# EAGLE design LurkerNanov12 (EAGLE 6.6.0)
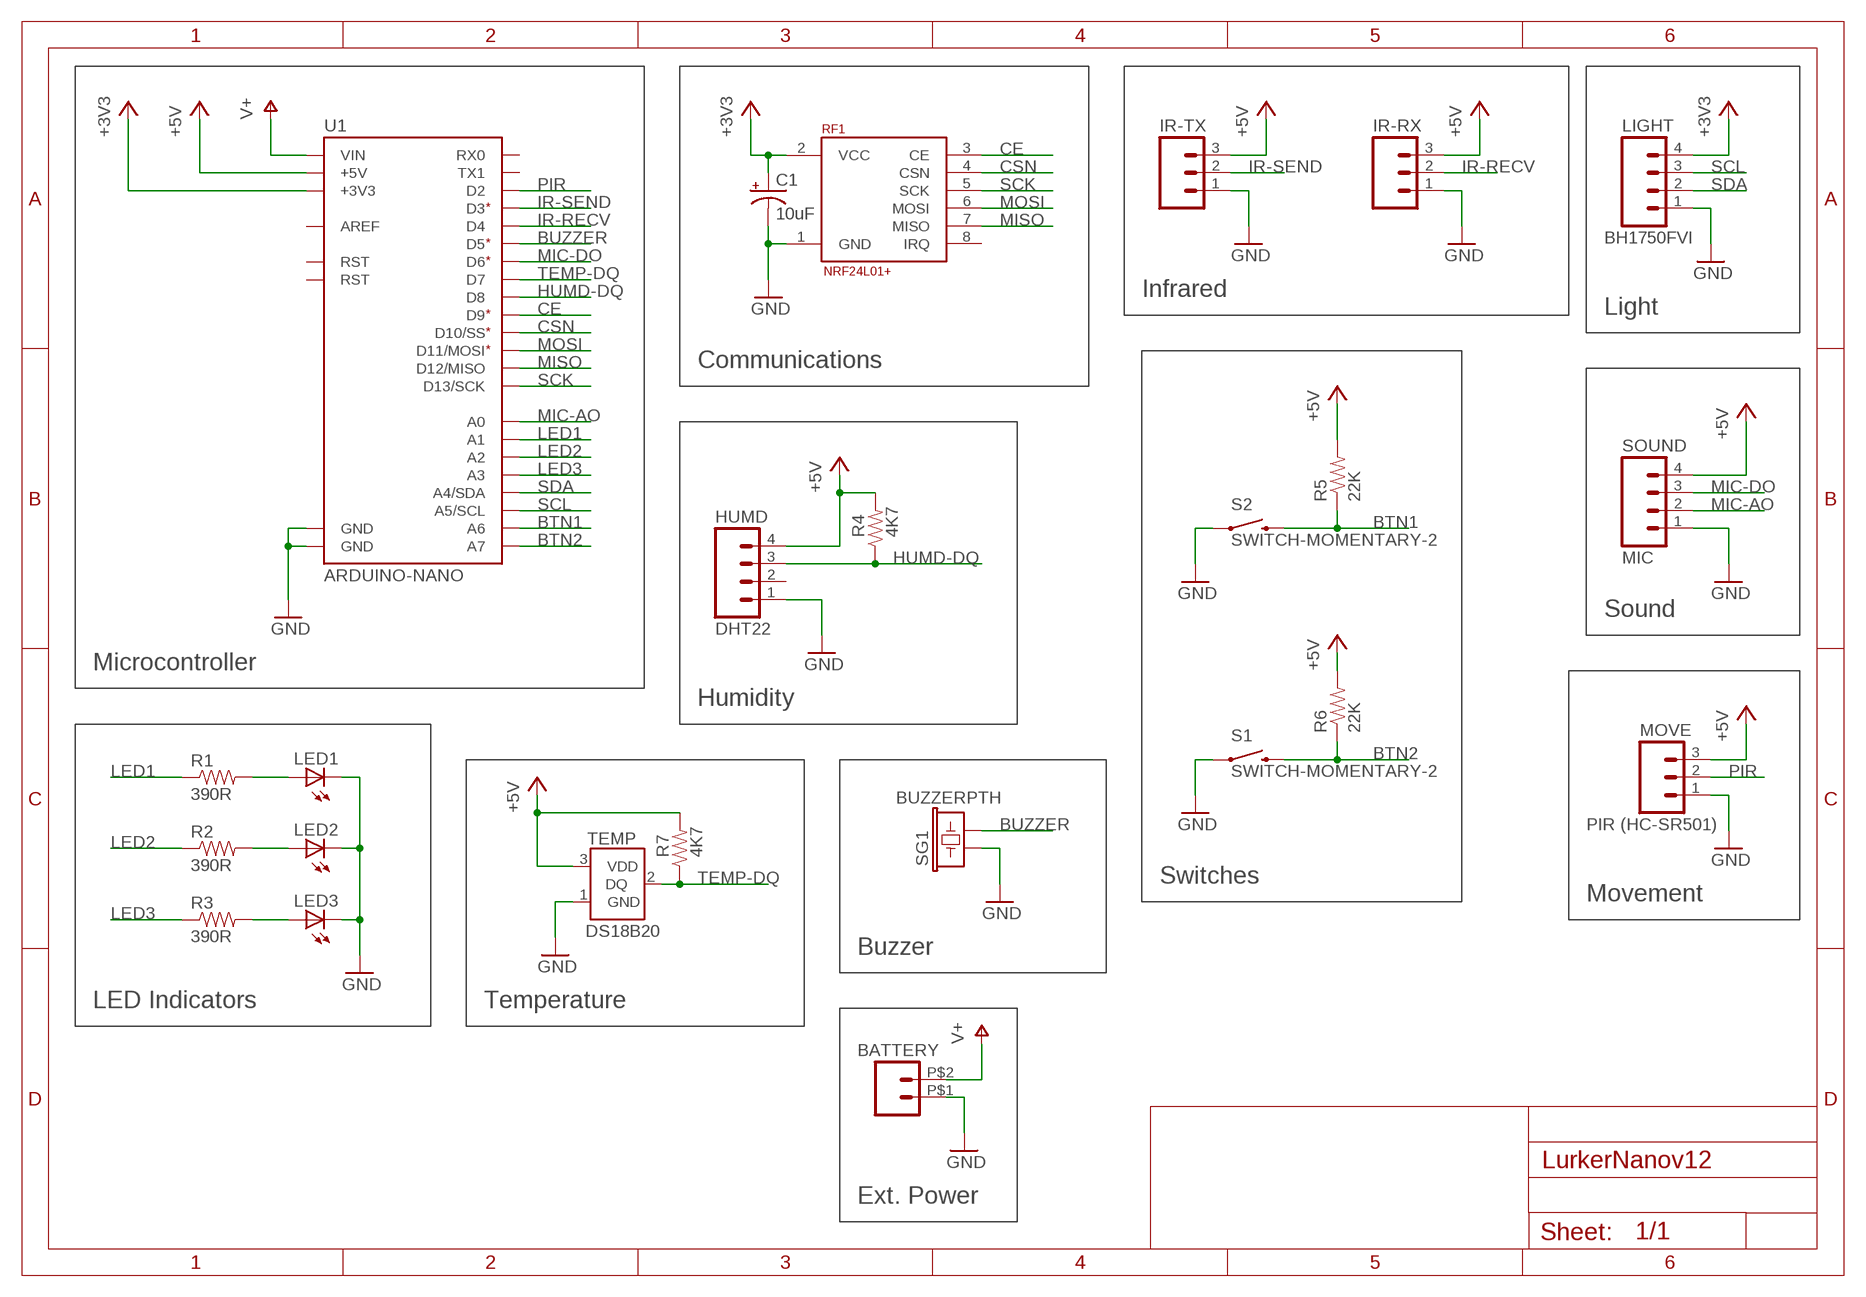
[diagram p0: schematic, sheet 1, part 1 of 2]
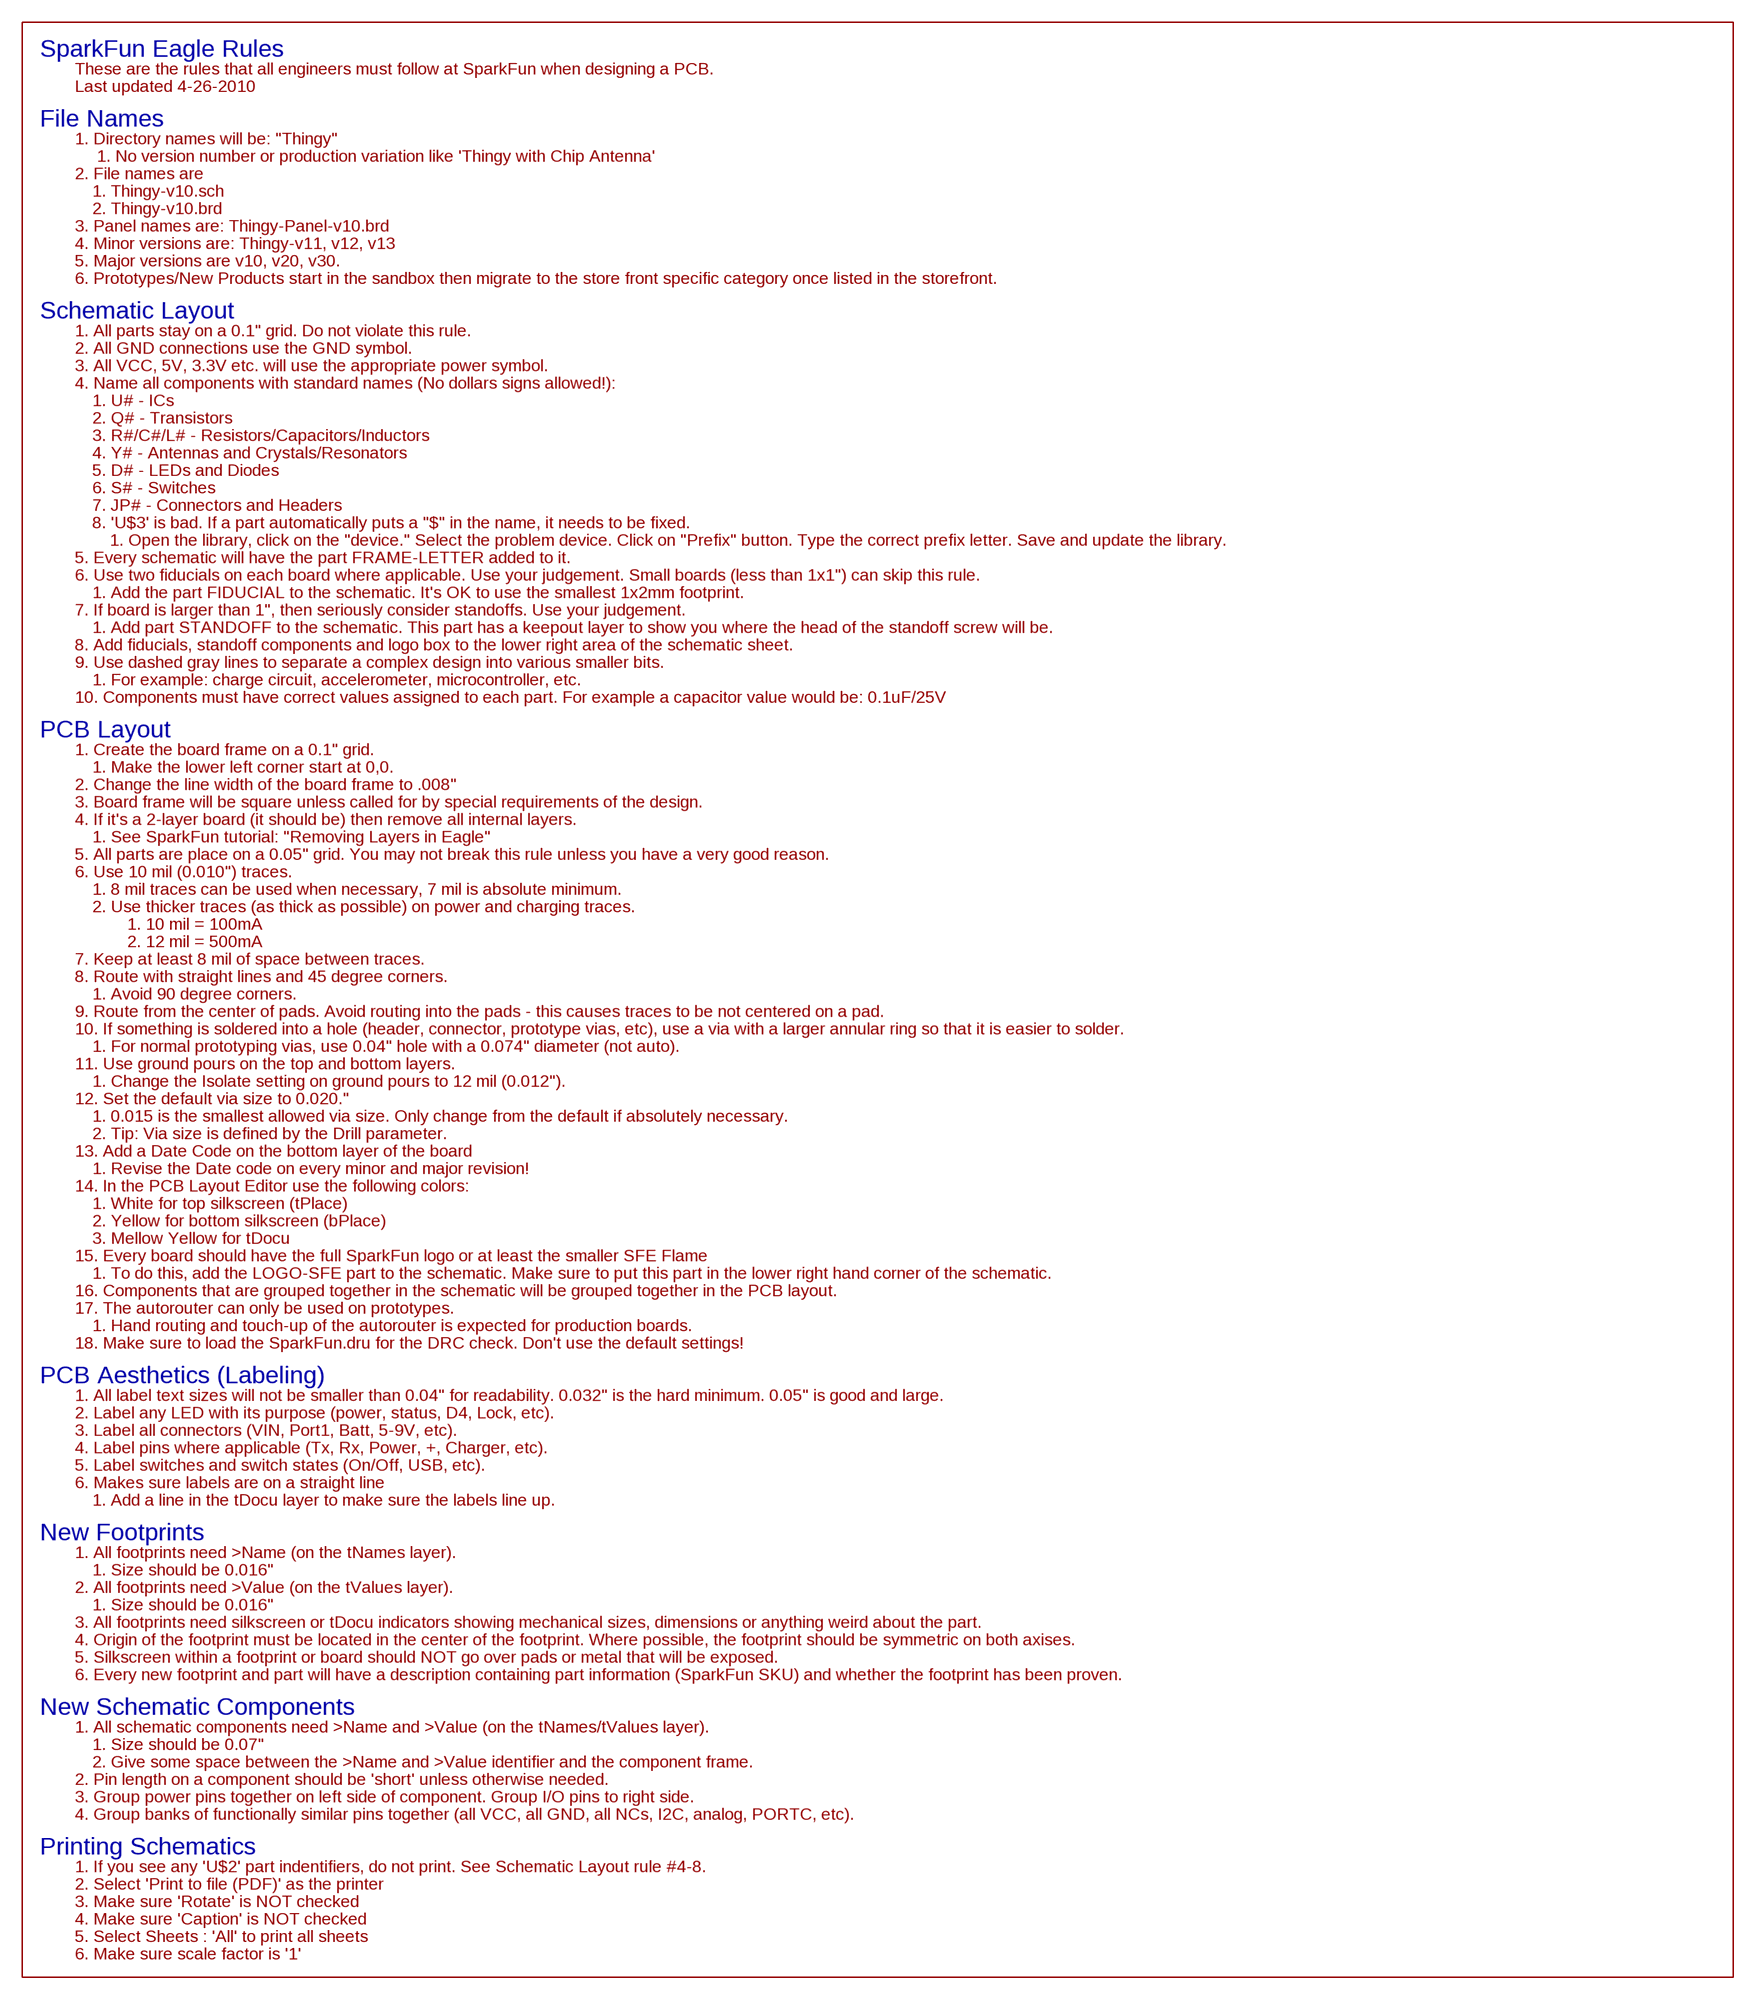
[diagram p1: schematic, sheet 1, part 2 of 2]

## Parts
BATTERY  M02PTH2  [1X02_BIG]
C1  10uF  CAP_POL1206  [EIA3216]
HUMD  DHT22  M04PTH  [1X04]
IR-RX  M03PTH  [1X03]
IR-TX  M03PTH  [1X03]
LED1  LED1206  [LED-1206]
LED2  LED1206  [LED-1206]
LED3  LED1206  [LED-1206]
LIGHT  BH1750FVI  M04PTH  [1X04]
MOVE  PIR (HC-SR501)  M03PTH  [1X03]
R1  390R  RESISTOR1206  [1206]
R2  390R  RESISTOR1206  [1206]
R3  390R  RESISTOR1206  [1206]
R4  4K7  RESISTOR1206  [1206]
R5  22K  RESISTOR1206  [1206]
R6  22K  RESISTOR1206  [1206]
R7  4K7  RESISTOR1206  [1206]
RF1  NRF24L01+  [NRF24L01+-HEADER]
S1  SWITCH-MOMENTARY-2  [TACTILE_SWITCH_TALL]
S2  SWITCH-MOMENTARY-2  [TACTILE_SWITCH_TALL]
SG1  BUZZERPTH  [BUZZER-12MM]
SOUND  MIC  M04PTH  [1X04]
TEMP  DS18B20  [TO-92-AMMO]
U1  ARDUINO-NANO  [NANO-SHIELD]

## Nets
+3V3: C1.A(+) LIGHT.4 RF1.2(VCC) U1.3V3(+3V3)
+5V: HUMD.4 IR-RX.3 IR-TX.3 MOVE.3 R4.2 R5.2 R6.2 R7.2 SOUND.4 TEMP.3(VDD) U1.5V(+5V)
BTN1: R5.1 S2.B2 U1.A6
BTN2: R6.1 S1.B2 U1.A7
BUZZER: SG1.- U1.D5
CE: RF1.3(CE) U1.D9
CSN: RF1.4(CSN) U1.D10(D10/SS)
GND: BATTERY.P$1 C1.C(-) HUMD.1 IR-RX.1 IR-TX.1 LED1.C LED2.C LED3.C LIGHT.1 MOVE.1 RF1.1(GND) S1.A2 S2.A2 SG1.+ SOUND.1 TEMP.1(GND) U1.GND@0(GND) U1.GND@1(GND)
HUMD-DQ: HUMD.3 R4.1 U1.D8
IR-RECV: IR-RX.2 U1.D4
IR-SEND: IR-TX.2 U1.D3
LED1: R1.1 U1.A1
LED2: R2.1 U1.A2
LED3: R3.1 U1.A3
MIC-AO: SOUND.2 U1.A0
MIC-DO: SOUND.3 U1.D6
MISO: RF1.7(MISO) U1.D12(D12/MISO)
MOSI: RF1.6(MOSI) U1.D11(D11/MOSI)
N$1: LED1.A R1.2
N$2: LED2.A R2.2
N$3: LED3.A R3.2
PIR: MOVE.2 U1.D2
SCK: RF1.5(SCK) U1.D13(D13/SCK)
SCL: LIGHT.3 U1.A5(A5/SCL)
SDA: LIGHT.2 U1.A4(A4/SDA)
TEMP-DQ: R7.1 TEMP.2(DQ) U1.D7
V+: BATTERY.P$2 U1.VIN
Unconnected: HUMD.2 RF1.8(IRQ) U1.REF(AREF) U1.RST U1.RST@0(RST) U1.RX(RX0) U1.TX(TX1)

## Notes on the sheet
- Infrared
- Light
- Communications
- Sound
- Microcontroller
- Humidity
- Switches
- Movement
- Buzzer
- LED Indicators | Temperature
- Ext. Power

## Library data of the parts
BATTERY = SparkFun-Connectors:M02: Header 2 Standard 2-pin 0.1" header. Use with straight break away headers (SKU : PRT-00116), right angle break away headers (PRT-00553), swiss pins (PRT-00743), machine pins (PRT-00117), and female headers (PRT-00115). Molex polarized connector foot print use with SKU : PRT-08233 with associated crimp pins and housings.
C1 = SparkFun-Capacitors:CAP_POL: Capacitor Polarized These are standard SMD and PTH capacitors. Normally 10uF, 47uF, and 100uF in electrolytic and tantalum varieties. Always verify the external diameter of the through hole cap, it varies with capacity, voltage, and manufacturer. The EIA devices should be standard.
HUMD LIGHT SOUND = SparkFun-Connectors:M04: Header 4 Standard 4-pin 0.1" header. Use with straight break away headers (SKU : PRT-00116), right angle break away headers (PRT-00553), swiss pins (PRT-00743), machine pins (PRT-00117), and female headers (PRT-00115). Molex polarized connector foot print use with SKU : PRT-08231 with associated crimp pins and housings. 1MM SMD Version SKU: PRT-10208
IR-RX IR-TX MOVE = SparkFun-Connectors:M03: Header 3 Standard 3-pin 0.1" header. Use with straight break away headers (SKU : PRT-00116), right angle break away headers (PRT-00553), swiss pins (PRT-00743), machine pins (PRT-00117), and female headers (PRT-00115). Molex polarized connector foot print use with SKU : PRT-08232 with associated crimp pins and housings.
LED1-LED3 = SparkFun-LED:LED: LEDs Standard schematic elements and footprints for 5mm, 3mm, 1206, and 0603 sized LEDs. 5mm - Spark Fun Electronics SKU : COM-00529 (and others)
R1-R7 = SparkFun-Resistors:RESISTOR: Resistor Basic schematic elements and footprints for 0603, 1206, and PTH resistors.
RF1 = Leenix:NRF24L01+
S1 S2 = SparkFun-Electromechanical:SWITCH-MOMENTARY-2: Various NO switches- pushbuttons, reed, etc
SG1 = SparkFun-Electromechanical:BUZZER: Buzzer 12mm Spark Fun Electronics SKU : Comp-Buzzer
TEMP = Leenix:DS18B20
U1 = Leenix:ARDUINO-NANO

## Board
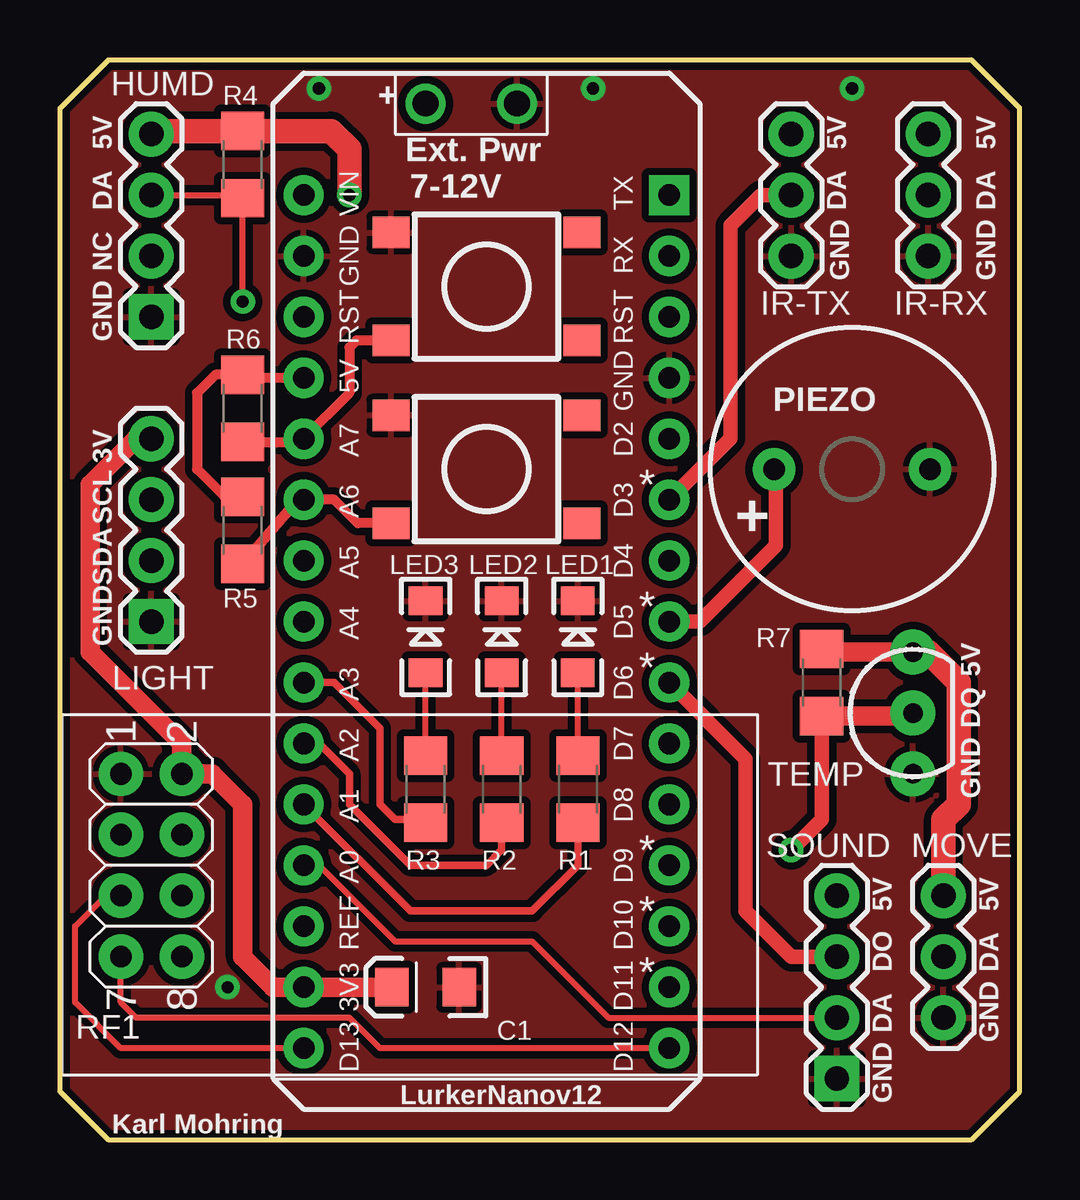
[diagram p2: board, top side]
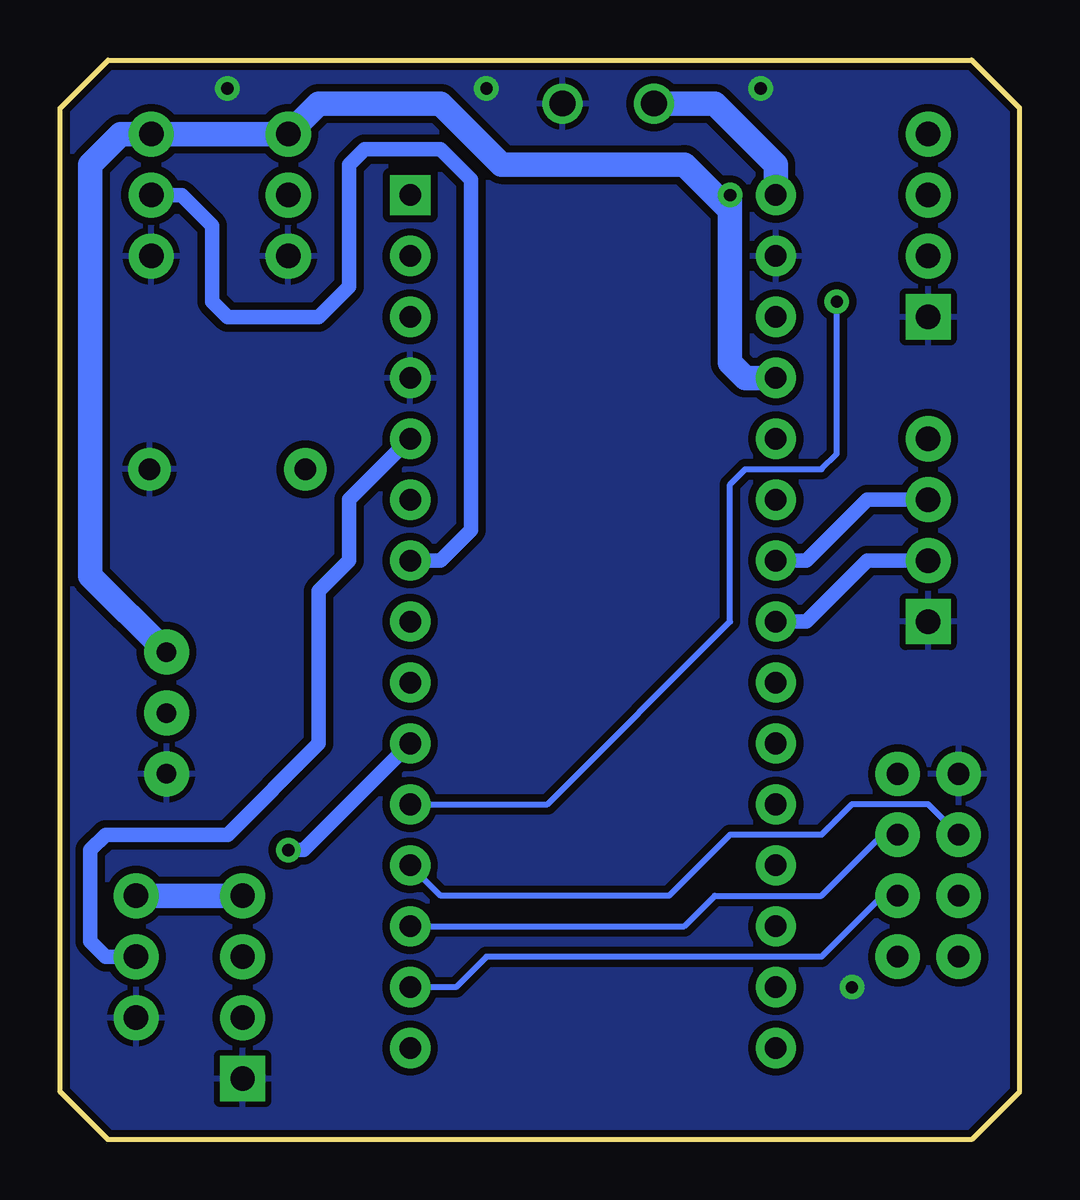
[diagram p3: board, bottom side, seen from below]

Size 40 x 45 mm. Coordinates in mm from the lower left corner, seen from the top.
Outline: 2,0 38,0 40,2 40,43 38,45 2,45 0,43 0,2 2,0
Copper layers (1*16): Top 0.035mm / dielectric 1.5mm / Bottom 0.035mm
Design rules "SparkFun": minimum track width 8mil, minimum drill 20mil, track to track 8mil, track to pad 8mil, pad to pad 8mil, via to via 8mil, smd to smd 8mil, copper to edge 10mil, drill to drill 8mil, minimum pad ring 12mil, minimum via ring 10mil, stop-mask expansion 4mil, vias tented up to drill 25mil, thermal gap 10mil

### Footprints (pad centres in the part's own frame; a part is rotated, then mirrored left to right if it is on the bottom)
1X02_BIG = drill 1.067: P$1 0,0; P$2 3.81,0
EIA3216 = smd 1.4 x 1.6: A 1.4,0; C -1.4,0
1X04 = drill 1.016 pad 1.88 square: 1 0,0 | drill 1.016 pad 1.88: 2 2.54,0; 3 5.08,0; 4 7.62,0
1X03 = drill 1.016 pad 1.88: 1 0,0; 2 2.54,0; 3 5.08,0
LED-1206 = smd 1.2 x 1.4: A -1.5,0; C 1.5,0
1206 = smd 1.6 x 1.8: 1 -1.4,0; 2 1.4,0
NRF24L01+-HEADER = drill 0.9 pad 1.85: 1 -2.54,-2.54; 2 -2.54,0; 3 0,-2.54; 4 0,0; 5 2.54,-2.54; 6 2.54,0; 7 5.08,-2.54; 8 5.08,0
TACTILE_SWITCH_TALL = smd 1.55 x 1.3: A1 -3.975,-2.25; A2 3.975,-2.25; B1 -3.975,2.25; B2 3.975,2.25
BUZZER-12MM = drill 0.9 pad 1.778: + 3.25,0; - -3.25,0
TO-92-AMMO = drill 0.813 pad 1.88: 1 -2.54,0; 2 0,0; 3 2.54,0
NANO-SHIELD = drill 0.9 pad 1.676: 3V3 0,2.54; 5V 0,27.94; A0 0,7.62; A1 0,10.16; A2 0,12.7; A3 0,15.24; A4 0,17.78; A5 0,20.32; A6 0,22.86; A7 0,25.4; D2 15.24,25.4; D3 15.24,22.86; D4 15.24,20.32; D5 15.24,17.78; D6 15.24,15.24; D7 15.24,12.7; D8 15.24,10.16; D9 15.24,7.62; D10 15.24,5.08; D11 15.24,2.54; D12 15.24,0; D13 0,0; GND@0 15.24,27.94; GND@1 0,33.02; REF 0,5.08; RST 0,30.48; RST@0 15.24,30.48; RX 15.24,33.02; VIN 0,35.56 | drill 0.9 pad 1.676 square: TX 15.24,35.56

### Placement (x,y rotation side)
BATTERY  19.05,43.18 180 top
C1  15.24,6.35 180 top
HUMD  3.81,34.29 90 top
IR-RX  36.2,36.83 90 top
IR-TX  30.48,36.83 90 top
LED1  21.59,20.95 90 top
LED2  18.41,20.95 90 top
LED3  15.24,20.95 90 top
LIGHT  3.81,21.59 90 top
MOVE  36.83,5.08 90 top
R1  21.59,14.61 90 top
R2  18.41,14.61 90 top
R3  15.24,14.61 90 top
R4  7.62,40.64 90 top
R5  7.62,25.4 90 top
R6  7.62,30.48 90 top
R7  31.75,19.05 90 top
RF1  5.08,12.7 270 top
S1  17.78,35.56 180 top
S2  17.78,27.94 180 top
SG1  33.02,27.94 0 top
SOUND  32.38,2.54 90 top
TEMP  35.56,17.78 90 top
U1  10.16,3.81 0 top

### Tracks (layer width: path | path; a pad name or v marks a point on that pad's centre or on a via)
+3V3
  Top 0.813: LIGHT.4 3.17,29.21 1.27,27.3 1.27,20.32 5.08,16.51 RF1.2 6.35,15.24 7.62,13.97 7.62,7.62 8.89,6.35 U1.3V3 C1.A
+5V  (via drill 0.51)
  Top 0.406: U1.5V 7.75,31.75 R6.2 6.48,31.88 5.71,31.11 5.71,27.94 6.86,26.8 R5.2
  Top 0.813: TEMP.3 31.88,20.32 R7.2
  Top 1.016: MOVE.3 36.83,13.34 37.47,13.97 37.47,19.05 36.2,20.32 TEMP.3 | HUMD.4 3.94,42.04 R4.2 11.3,42.04 12.06,41.27 v12.06,39.37
  Bottom 1.016: TEMP.3 38.73,23.5 38.73,40.64 37.47,41.91 IR-RX.3 IR-TX.3 29.21,43.18 24.13,43.18 21.59,40.64 13.97,40.64 12.06,38.73 | MOVE.3 SOUND.4 | U1.5V 11.43,31.75 12.06,32.38 12.06,38.73 | v12.06,39.37 12.06,38.73
BTN1
  Top 0.406: S2.B2 12.41,25.69 11.43,26.67 U1.A6 10.03,26.8 R5.1
BTN2
  Top 0.406: R6.1 10.03,29.08 U1.A7 12.06,31.11 12.06,33.02 12.36,33.31 S1.B2
BUZZER
  Top 0.61: U1.D5 26.67,21.59 29.84,24.77 29.84,27.86 SG1.-
CE
  Bottom 0.254: RF1.3 3.81,13.97 6.99,13.97 8.26,12.7 12.06,12.7 14.61,10.16 24.13,10.16 U1.D9
CSN
  Bottom 0.254: U1.D10 13.97,8.89 12.7,10.16 8.26,10.16 5.71,12.7 RF1.4
GND  (via drill 0.51)
  other vias: 33.02,43.81 10.79,43.81 22.23,43.81 6.99,6.35
  pour Top (isolate 0.305): 0,0 0,43.18 1.91,45.09 40.64,45.09 40.64,2.54 38.1,0
  pour Bottom (isolate 0.305): 40.64,0 40.64,42.55 38.1,45.09 -0.64,45.09 -0.64,2.54 1.91,0
HUMD-DQ  (via drill 0.51)
  Top 0.254: 6.99,38.6 R4.1 | HUMD.3 7.49,39.37 R4.1 | v7.62,34.92 R4.1
  Bottom 0.254: U1.D8 19.68,13.97 12.06,21.59 12.06,27.3 11.43,27.94 8.26,27.94 7.62,28.57 v7.62,34.92
IR-RECV
  Bottom 0.61: U1.D4 24.13,24.13 22.86,25.4 22.86,40.01 24.13,41.27 27.3,41.27 27.94,40.64 27.94,35.56 29.21,34.29 33.02,34.29 33.66,34.92 33.66,38.1 34.92,39.37 IR-RX.2
IR-SEND
  Top 0.61: IR-TX.2 29.21,39.37 27.94,38.1 27.94,29.21 U1.D3
LED1
  Top 0.305: U1.A1 14.61,9.53 19.68,9.53 21.59,11.43 R1.1
LED2
  Top 0.305: U1.A2 10.79,16.51 12.06,15.24 12.06,13.97 14.61,11.43 17.78,11.43 18.41,12.06 R2.1
LED3
  Top 0.305: U1.A3 11.43,19.05 13.34,17.14 13.34,13.97 13.97,13.34 15.11,13.34 R3.1
MIC-AO
  Top 0.254: U1.A0 10.79,11.43 13.97,8.26 19.68,8.26 22.86,5.08 SOUND.2
MIC-DO
  Top 0.61: SOUND.3 30.48,7.62 28.57,9.53 28.57,15.88 U1.D6
MISO
  Top 0.254: U1.D12 13.34,3.81 12.06,5.08 3.17,5.08 2.54,5.71 RF1.7
MOSI
  Bottom 0.254: RF1.6 5.71,10.16 8.26,7.62 22.23,7.62 23.5,6.35 U1.D11
N$1
  Top 0.254: R1.2 LED1.A
N$2
  Top 0.254: R2.2 LED2.A
N$3
  Top 0.254: R3.2 LED3.A
PIR
  Bottom 0.61: MOVE.2 38.1,7.62 38.73,8.26 38.73,12.06 38.1,12.7 33.02,12.7 29.21,16.51 29.21,22.86 27.94,24.13 27.94,26.67 U1.D2
SCK
  Top 0.254: U1.D13 2.54,3.81 0.64,5.71 0.64,8.89 1.91,10.16 RF1.5
SCL
  Bottom 0.61: LIGHT.3 6.35,26.67 8.89,24.13 U1.A5
SDA
  Bottom 0.61: U1.A4 8.89,21.59 6.35,24.13 LIGHT.2
TEMP-DQ  (via drill 0.51)
  Top 0.61: R7.1 31.75,13.34 v30.48,12.06
  Top 0.813: R7.1 35.43,17.65 TEMP.2
  Bottom 0.61: v30.48,12.06 29.84,12.06 U1.D7
V+
  Bottom 1.016: U1.VIN 10.16,40.64 12.7,43.18 BATTERY.P$2

### Text on the board
tPlace: + | Ext. Pwr | 5V | 5V | 5V | 7-12V | DA | DA | DA | NC | GND | GND | GND | PIEZO | 3V | + | SCL | SDA | GND | 5V | DQ | GND | 5V | 5V | DO | DA | DA | GND | GND | Karl Mohring